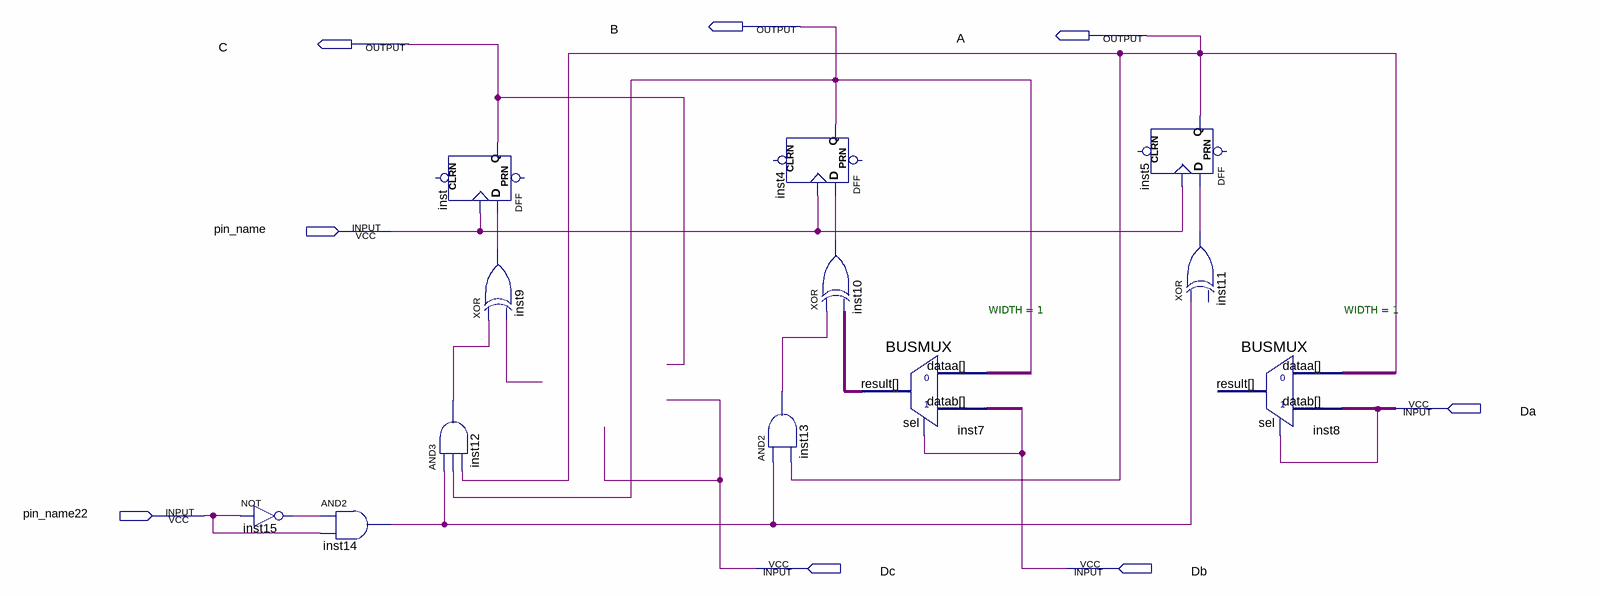
[diagram p0: schematic sheet]
// Quartus schematic p12-20.bdf as structural Verilog: 12 symbols, 8 pins
module \p12-20  (
  input  pin_name,
  input  Da,
  input  pin_name22,
  input  Dc,
  input  Db,
  output B,
  output A,
  output C
);

  wire inst7_result, inst9_out, inst10_out, inst11_out, inst12_out, inst13_out, inst14_out, inst15_out,
       undriven, undriven_2, undriven_3, undriven_4;

  not inst15 (inst15_out, pin_name22);
  and inst14 (inst14_out, inst15_out, pin_name22);
  DFF inst (.CLK(pin_name), .D(inst9_out), .Q(C));  // open: CLRN, PRN
  and inst12 (inst12_out, inst14_out, B, A);
  xor inst9 (inst9_out, inst12_out, undriven_4);
  DFF inst4 (.CLK(pin_name), .D(inst10_out), .Q(B));  // open: CLRN, PRN
  and inst13 (inst13_out, inst14_out, A);
  xor inst10 (inst10_out, inst13_out, inst7_result);
  BUSMUX #(.WIDTH(1)) inst7 (.datab(undriven_3), .sel(Db), .dataa(undriven_2), .result(inst7_result));
  DFF inst5 (.CLK(pin_name), .D(inst11_out), .Q(A));  // open: CLRN, PRN
  buf inst11 (inst11_out, inst14_out);  // XOR open: IN2
  BUSMUX #(.WIDTH(1)) inst8 (.datab(Da), .sel(Da), .dataa(undriven));  // open: result
endmodule
